# Altium schematic sheet BAT.SchDoc
size A3; SheetNumber: 1; SheetTotal: 5
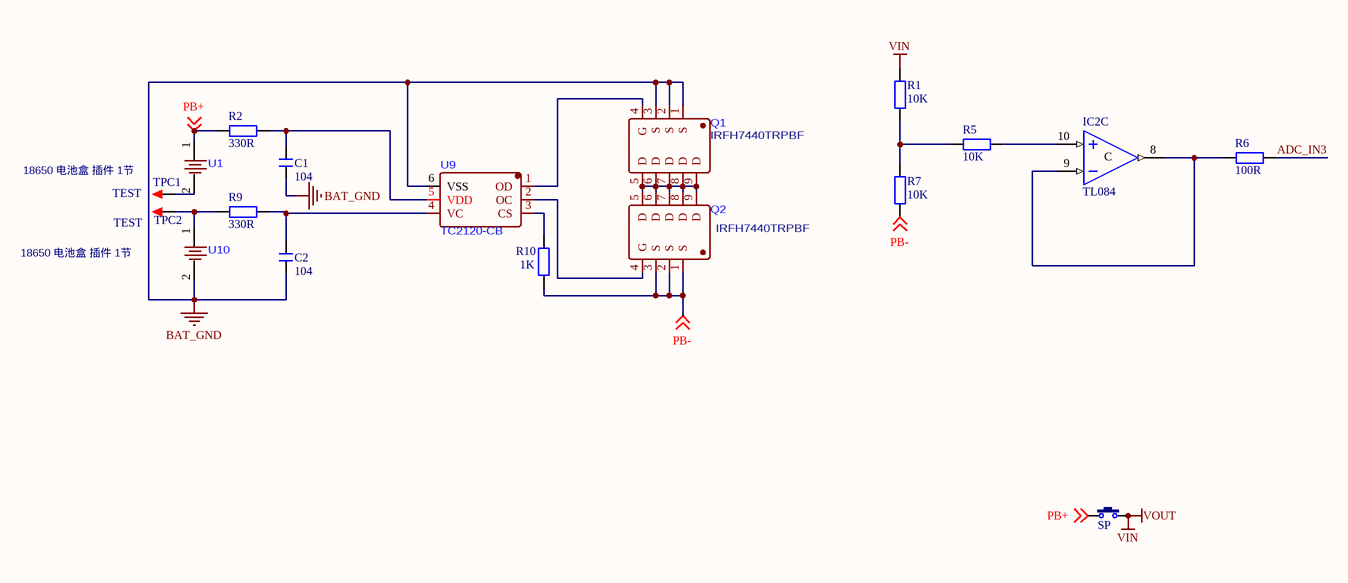
[diagram p0: BAT.SchDoc]

## Parts
C1  104  [C 0805_L]
C2  104  [C 0805_L]
IC2  TL084  [SOP14_N]  (part C of 4)
Q1  IRFH7440TRPBF  [PQFN-8P_L5.8-W4.9-P1.27-LS6.0-BL]
Q2  IRFH7440TRPBF  [PQFN-8P_L5.8-W4.9-P1.27-LS6.0-BL]
R1  10K  [R 0805_L]
R2  330R  [R 0805_L]
R5  10K  [R 0805_L]
R6  100R  [R 0805_L]
R7  10K  [R 0805_L]
R9  330R  [R 0805_L]
R10  1K  [R 0805_L]
SP  6x6x5  [KEY-TH_CN-KCD11]  (value not drawn)
TPC1  TEST  [TEST 1.6]
TPC2  TEST  [TEST 1.6]
U1  18650 电池盒 插件 1节  [BAT-TH_18650-C9900004923]
U9  TC2120-CB  [SOT23-6L]
U10  18650 电池盒 插件 1节  [BAT-TH_18650-C9900004923]

## Nets
BAT_GND: C1.1 C2.1 Q1.1(S) Q1.2(S) Q1.3(S) U9.6(VSS) U10.2
VIN: R1.1 SP.2  [also labelled VOUT]
ADC_IN3: R6.1
PB+: R2.2 SP.1 U1.1 ; off-sheet PB+
PB-: Q2.1(S) Q2.2(S) Q2.3(S) R7.2 R10.2 ; off-sheet PB-
NetC1_2: C1.2 R2.1 U9.5(VDD)
NetC2_2: C2.2 R9.1 U9.4(VC)
NetIC2_8: IC2.8(OUT) IC2.9(IN-) R6.2
NetIC2_10: IC2.10(IN+) R5.1
NetQ1_4: Q1.4(G) U9.1(OD)
NetQ1_5: Q1.5(D) Q1.6(D) Q1.7(D) Q1.8(D) Q1.9(D) Q2.5(D) Q2.6(D) Q2.7(D) Q2.8(D) Q2.9(D)
NetQ2_4: Q2.4(G) U9.2(OC)
NetR1_2: R1.2 R5.2 R7.1
NetR9_2: R9.2 TPC2.1 U10.1
NetR10_1: R10.1 U9.3(CS)
NetTPC1_1: TPC1.1 U1.2

## Notes on the sheet
- (in symbol TL084, part C) C

## Library data of the parts
C1 C2 = C: 无极性贴片电容; 版权归属: 源创客; 材质: X7R; BOM名称: 无极性贴片电容; 学习资源: www.ooocke.com
IC2 = TL084: 4路运放; 版权归属: 源创客; BOM名称: 4路运放; 学习资源: www.ooocke.com
R1 R2 R5-R7 R9 R10 = R: 贴片电阻; 版权归属: 源创客; BOM名称: 贴片电阻; 学习资源: www.ooocke.com
SP = TSW DIP-2Pin-6x6: 2脚直插6x6轻触开关; BOM名称: 2脚轻触开关; 版权归属: 源创客; 学习资源: www.ooocke.com
TPC1 TPC2 = TEST: 测试点; 版权归属: 源创客; BOM名称: 测试点; 学习资源: www.ooocke.com